# EasyEDA schematic SCH_beancounter.json
TITLE: Sheet_1; REV: 1.0; Date: 2022-05-26; Sheet: 1/1; Drawn By: sunhaoqin; Company: Your Company
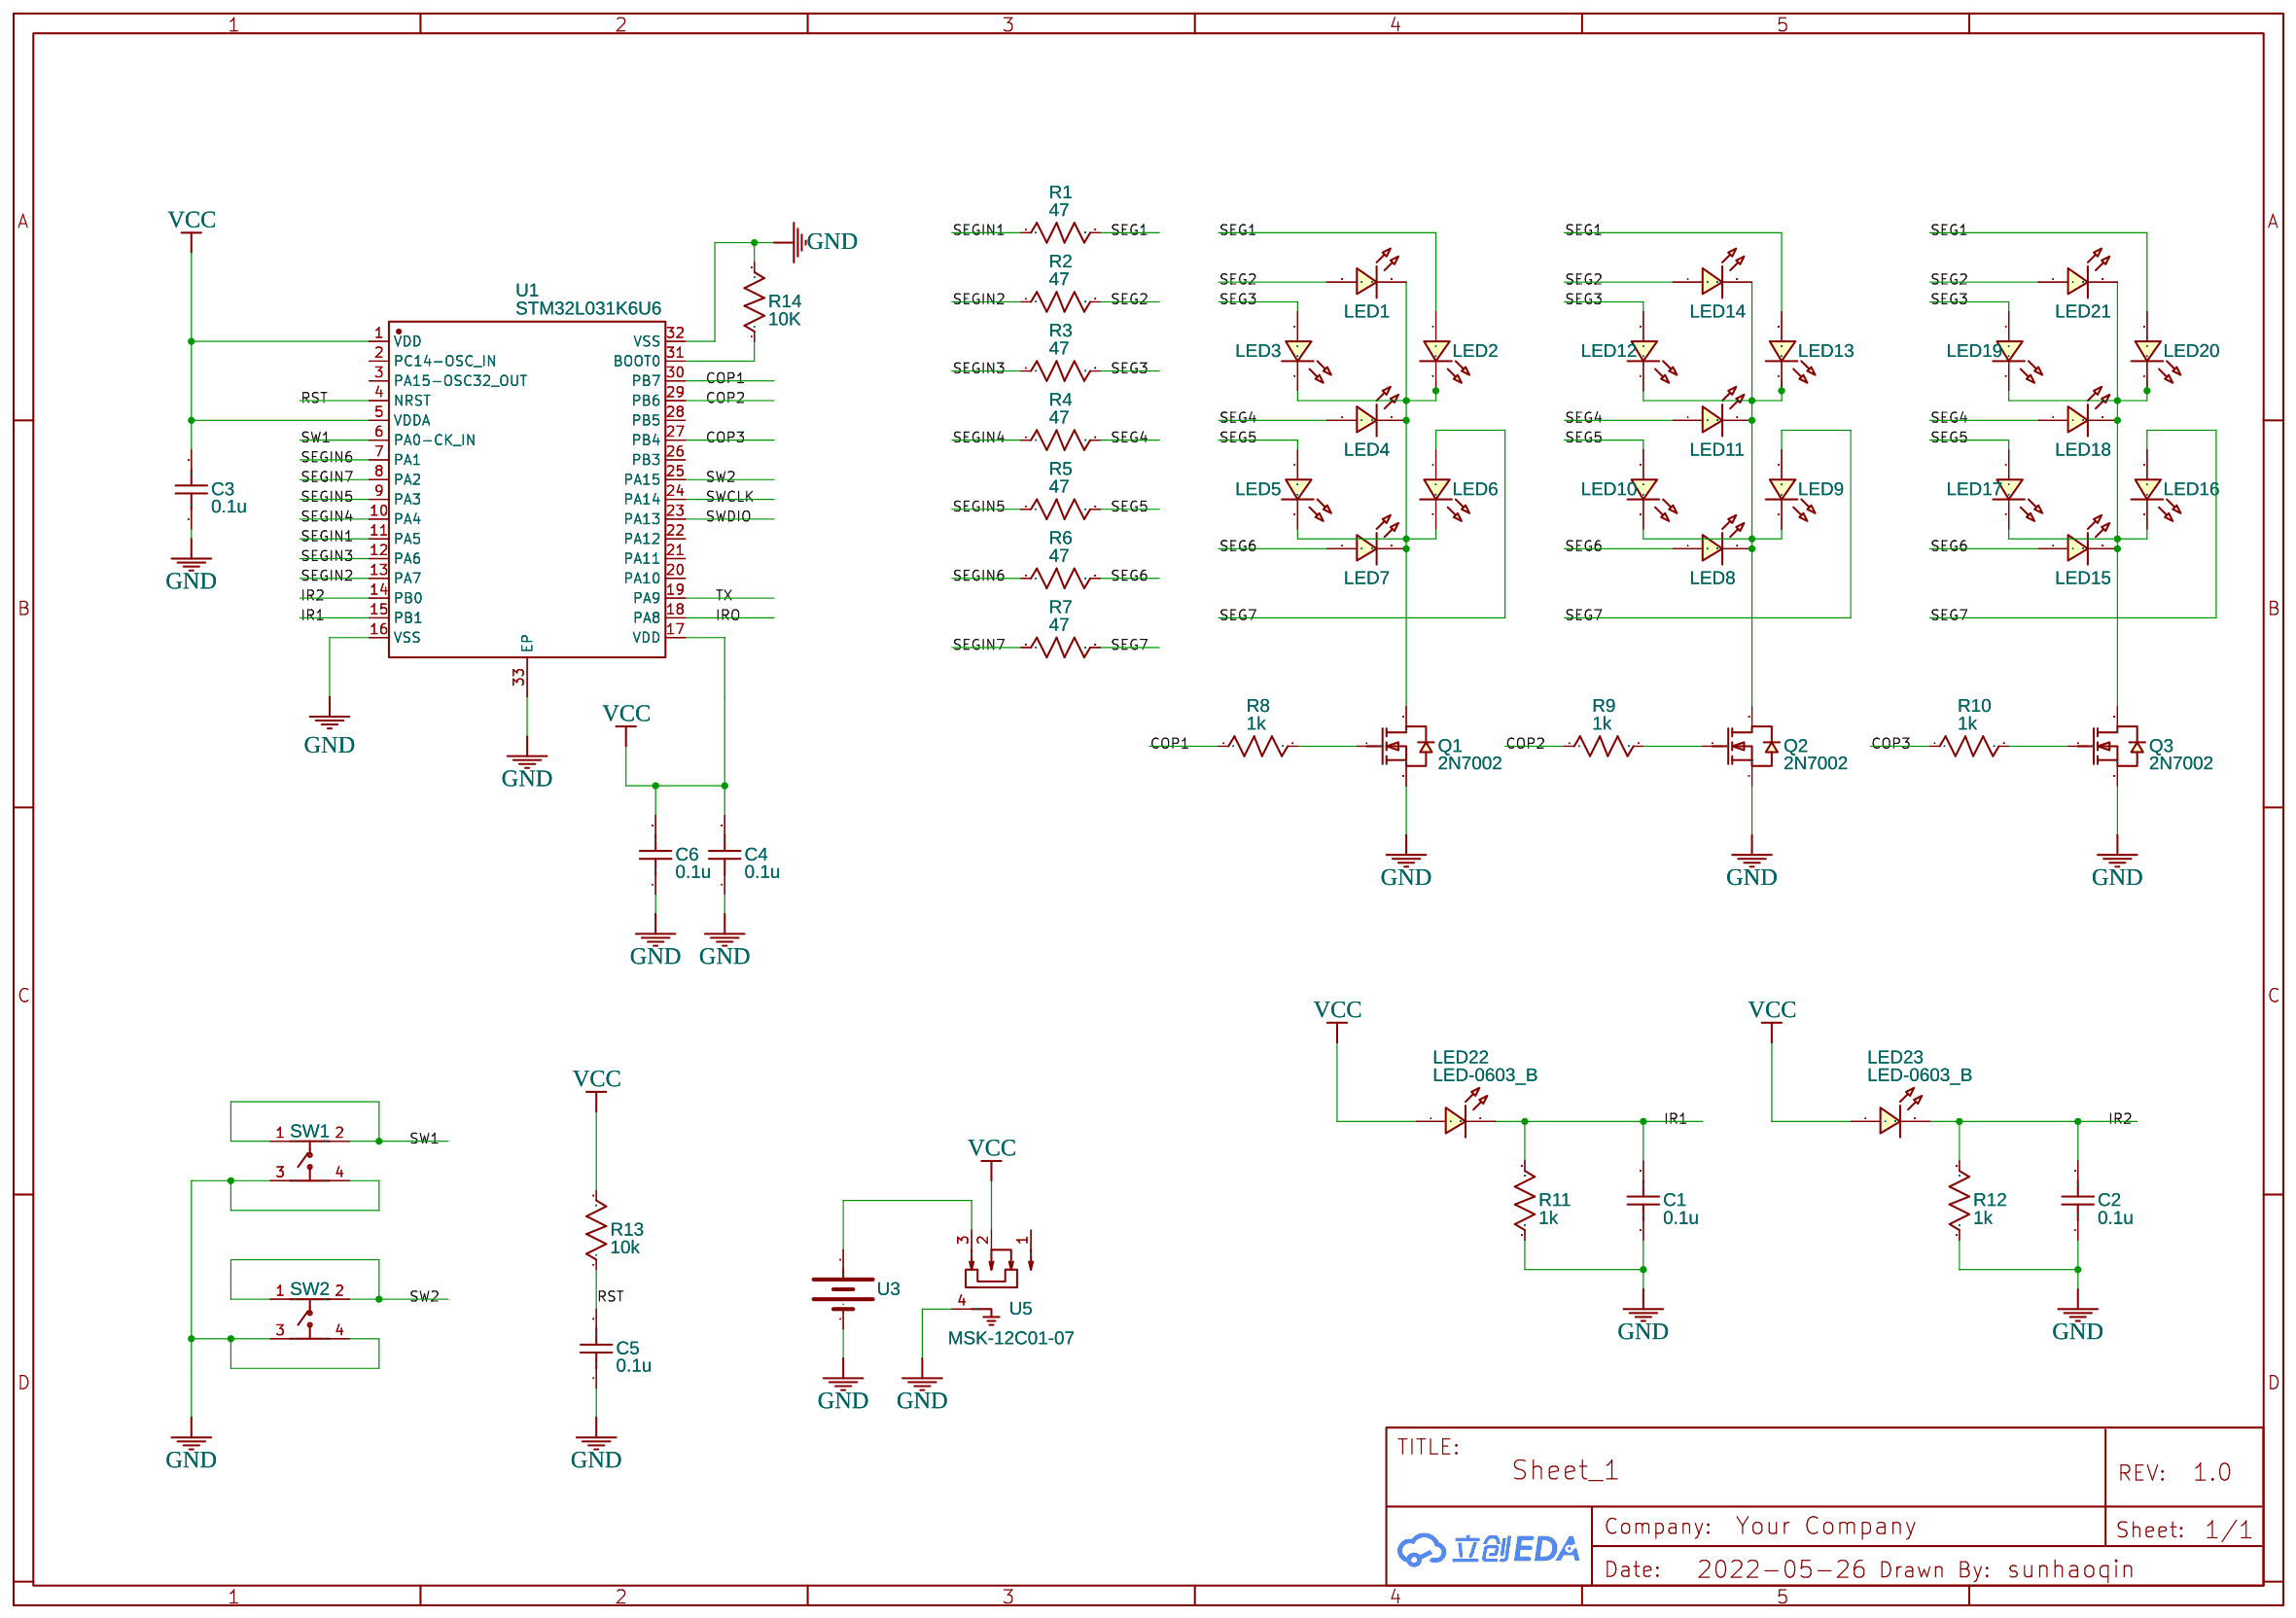
[diagram p0: schematic sheet]

## Parts
C1  0.1u  [C0603]
C2  0.1u  [C0603]
C3  0.1u  [C0603]
C4  0.1u  [C0603]
C5  0.1u  [C0603]
C6  0.1u  [C0603]
LED1  LED-0603_B  [LED0603_BLUE]
LED2  LED-0603_B  [LED0603_BLUE]
LED3  LED-0603_B  [LED0603_BLUE]
LED4  LED-0603_B  [LED0603_BLUE]
LED5  LED-0603_B  [LED0603_BLUE]
LED6  LED-0603_B  [LED0603_BLUE]
LED7  LED-0603_B  [LED0603_BLUE]
LED8  LED-0603_B  [LED0603_BLUE]
LED9  LED-0603_B  [LED0603_BLUE]
LED10  LED-0603_B  [LED0603_BLUE]
LED11  LED-0603_B  [LED0603_BLUE]
LED12  LED-0603_B  [LED0603_BLUE]
LED13  LED-0603_B  [LED0603_BLUE]
LED14  LED-0603_B  [LED0603_BLUE]
LED15  LED-0603_B  [LED0603_BLUE]
LED16  LED-0603_B  [LED0603_BLUE]
LED17  LED-0603_B  [LED0603_BLUE]
LED18  LED-0603_B  [LED0603_BLUE]
LED19  LED-0603_B  [LED0603_BLUE]
LED20  LED-0603_B  [LED0603_BLUE]
LED21  LED-0603_B  [LED0603_BLUE]
LED22  LED-0603_B  [LED0603_BLUE]
LED23  LED-0603_B  [LED0603_BLUE]
Q1  2N7002  [SOT-23_L2.9-W1.3-P0.95-LS2.4-BR]
Q2  2N7002  [SOT-23_L2.9-W1.3-P0.95-LS2.4-BR]
Q3  2N7002  [SOT-23_L2.9-W1.3-P0.95-LS2.4-BR]
R1  47  [R0603]
R2  47  [R0603]
R3  47  [R0603]
R4  47  [R0603]
R5  47  [R0603]
R6  47  [R0603]
R7  47  [R0603]
R8  1k  [R0603]
R9  1k  [R0603]
R10  1k  [R0603]
R11  1k  [R0603]
R12  1k  [R0603]
R13  10k  [R0603]
R14  10K  [R0603]
SW1  TSC005B1526A  [SW-SMD_4P-L5.2-W5.2-P3.70-LS6.4]
SW2  TSC005B1526A  [SW-SMD_4P-L5.2-W5.2-P3.70-LS6.4]
U1  STM32L031K6U6  [UFQFPN-32_L5.0-W5.0-P0.50-BL-EP3.5]
U3  CR2032-卧式贴片JACOB  [BAT-SMD_CR2032-AAA]
U5  MSK-12C01-07  [SW-SMD_MSK12CO2-BDM]

## Library data of the parts
C1-C6 = C_0603_US: Contributor: LCEDA_Lib
LED1-LED23 = LED-0603_B: Manufacturer: EVERLIGHT(台湾亿光); Manufacturer Part: 19-217/BHC-ZL1M2RY/3T; Supplier Part: C72041; Supplier: LCSC; Contributor: LCEDA_01
Q1-Q3 = 2N7002: Supplier: LCSC; Manufacturer: Nexperia; Manufacturer Part: 2N7002,215; image: //image.lceda.cn/szlcsc/C65189.jpg; Supplier Part: C65189; Paste Type: expand; Contributor: LCEDA_Lib
R1-R14 = R_0603_US: Contributor: LCEDA_Lib
SW1 SW2 = TSC005B1526A: Supplier: LCSC; Supplier Part: C2888895; Manufacturer: BZCN(博众电气); Contributor: LCSC
U1 = STM32L031K6U6: Supplier: LCSC; Supplier Part: C967648; Manufacturer: ST(意法半导体); link: https://atta.szlcsc.comnull; Contributor: lcsc; JLCPCB Part Class: Extended Part
U3 = CR2032-卧式贴片JACOB: Supplier: LCSC; Supplier Part: C9900005595; Manufacturer: null; Manufacturer Part: CR2032-卧式贴片; JLCPCB Part Class: Extended Part; Contributor: LCSC; Package Display: No
U5 = MSK-12C01-07: Supplier: LCSC; Supplier Part: C9900005167; Manufacturer: null; JLCPCB Part Class: Extended Part; Contributor: lcsc

## Nets
GND: C1.1 C2.1 C3.1 C4.1 C5.1 C6.1 Q1.2(S) Q2.2(S) Q3.2(S) R11.1 R12.1 R14.2 SW1.3 SW1.4 SW2.3 SW2.4 U1.16(VSS) U1.32(VSS) U1.33(EP) U3.1(-) U5.4
VCC: C3.2 C4.2 C6.2 LED22.1 LED23.1 R13.2 U1.1(VDD) U1.5(VDDA) U1.17(VDD) U5.2
COP1: R8.1 U1.30(PB7)
COP2: R9.1 U1.29(PB6)
COP3: R10.1 U1.27(PB4)
IR1: C1.2 LED22.2 R11.2 U1.15(PB1)
IR2: C2.2 LED23.2 R12.2 U1.14(PB0)
IRO: U1.18(PA8)
RST: C5.2 R13.1 U1.4(NRST)
SEG1: LED2.1 LED13.1 LED20.1 R1.2
SEG2: LED1.1 LED14.1 LED21.1 R2.2
SEG3: LED3.1 LED12.1 LED19.1 R3.2
SEG4: LED4.1 LED11.1 LED18.1 R4.2
SEG5: LED5.1 LED10.1 LED17.1 R5.2
SEG6: LED7.1 LED8.1 LED15.1 R6.2
SEG7: LED6.1 LED9.1 LED16.1 R7.2
SEGIN1: R1.1 U1.11(PA5)
SEGIN2: R2.1 U1.13(PA7)
SEGIN3: R3.1 U1.12(PA6)
SEGIN4: R4.1 U1.10(PA4)
SEGIN5: R5.1 U1.9(PA3)
SEGIN6: R6.1 U1.7(PA1)
SEGIN7: R7.1 U1.8(PA2)
SW1: SW1.1 SW1.2 U1.6(PA0-CK_IN)
SW2: SW2.1 SW2.2 U1.25(PA15)
SWCLK: U1.24(PA14)
SWDIO: U1.23(PA13)
TX: U1.19(PA9)
Net-(LED1-2): LED1.2 LED2.2 LED3.2 LED4.2 LED5.2 LED6.2 LED7.2 Q1.3(D)
Net-(LED8-2): LED8.2 LED9.2 LED10.2 LED11.2 LED12.2 LED13.2 LED14.2 Q2.3(D)
Net-(LED15-2): LED15.2 LED16.2 LED17.2 LED18.2 LED19.2 LED20.2 LED21.2 Q3.3(D)
Net-(Q1-1): Q1.1(G) R8.2
Net-(Q2-1): Q2.1(G) R9.2
Net-(Q3-1): Q3.1(G) R10.2
Net-(R14-1): R14.1 U1.31(BOOT0)
Net-(U3-2): U3.2(+) U5.3

Not connected (* = marked no-connect by the designer): U1 2(PC14-OSC_IN) 3(PA15-OSC32_OUT) 20(PA10) 21(PA11) 22(PA12) 26(PB3) 28(PB5); U5 1
